# EAGLE design RS232_2xNPN_Alt (EAGLE 7.7.0)
RS232 Adapter using two NPN Transistors
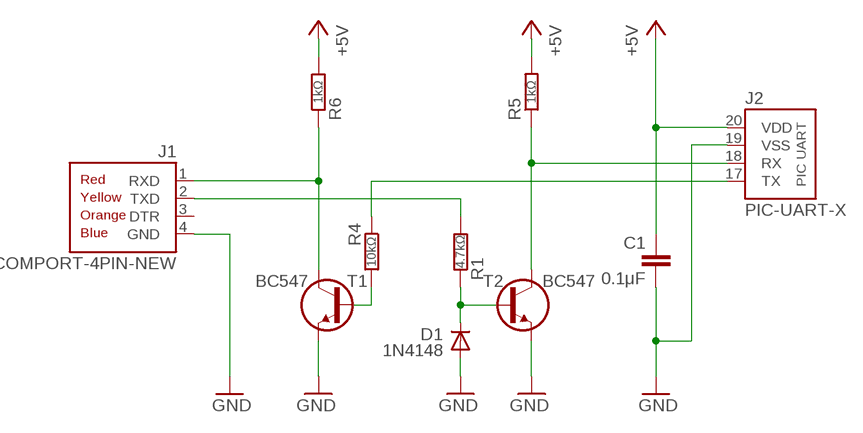
[diagram p0: schematic, sheet 1]

## Parts
C1  0.1μF  C025-015X024  [C025-015X024]
D1  1N4148  1N414834-7  [DO34-7]
J1  COMPORT-4PIN-NEW  [RS232-4PIN-NEW]
J2  PIC-UART-X  [PIC-UART-X]
R1  4.7kΩ  R0202/7  [0202/7]
R4  10kΩ  R0204/7-V  [0204/7-V]
R5  1kΩ  R0204/7-V  [0204/7-V]
R6  1kΩ  R0204/7  [0204/7]
T1  BC547  BC547CBE  [TO92-CBE]
T2  BC547  BC547CBE  [TO92-CBE]

## Nets
+5V: C1.1 J2.20(VDD) R5.2 R6.2
GND: C1.2 D1.A J1.4(GND) J2.19(VSS) T1.E T2.E
N$1: J2.18(RX) R5.1 T2.C
N$2: D1.C R1.1 T2.B
N$3: J1.2(TXD) R1.2
N$4: J2.17(TX) R4.1
N$5: R4.2 T1.B
N$9: J1.1(RXD) R6.1 T1.C
Unconnected: J1.3(DTR)

## Library data of the parts
C1 = c:C: CAPACITOR, European symbol
D1 = d:1N4148
J1 = pinconn:COMPORT-4PIN-NEW
J2 = pinconn:PIC-UART
R1 R4-R6 = r:R: RESISTOR, European symbol
T1 T2 = t:BC547

## Net classes
0 default: width 0.61 mm

## Board
RS232 Adapter using two NPN Transistors
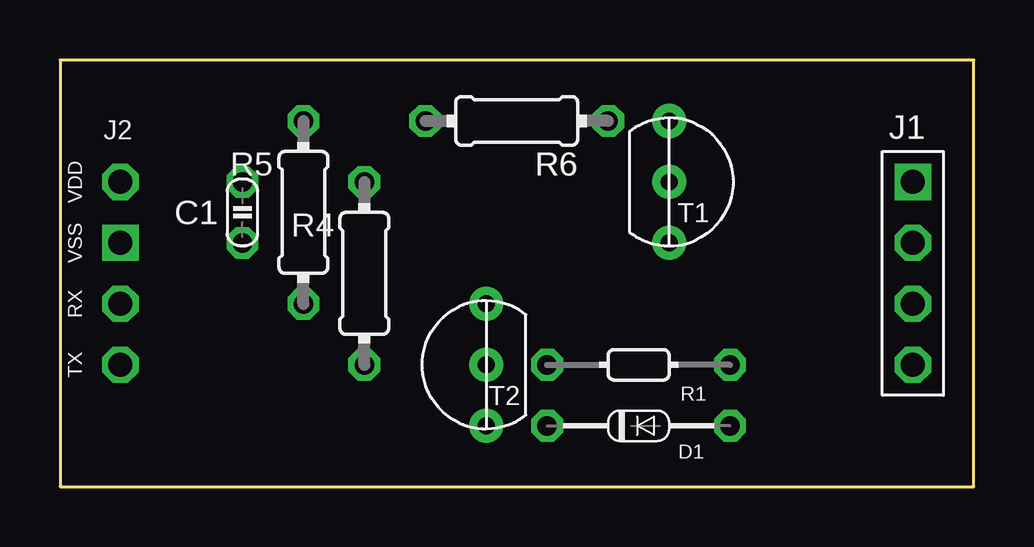
[diagram p1: board, top side]
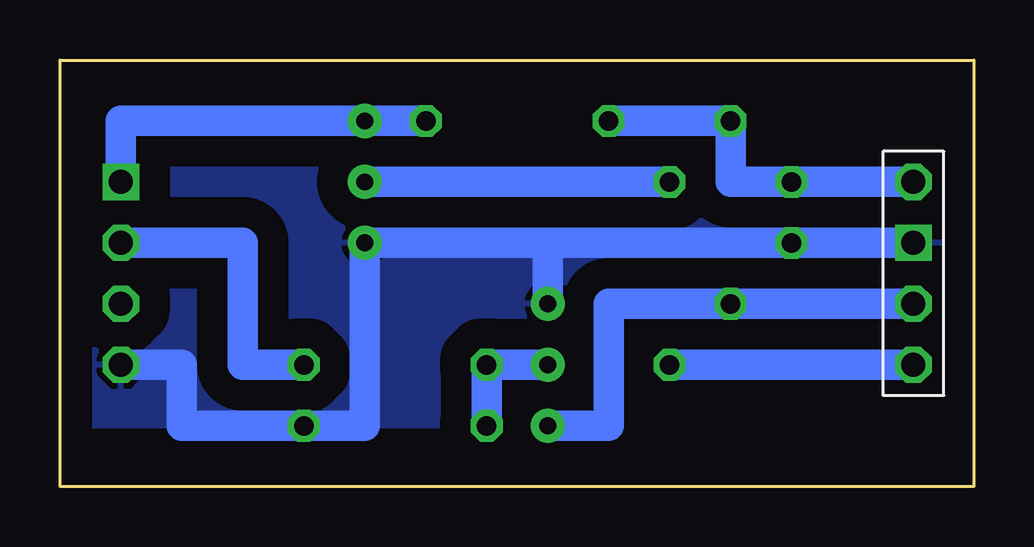
[diagram p2: board, bottom side, seen from below]

Size 38.08 x 17.78 mm. Coordinates in mm from the lower left corner, seen from the top.
Outline: 38.08,17.78 0,17.78 0,0 38.08,0 38.08,17.78
Copper layers (1*16): Top 0.035mm / dielectric 1.5mm / Bottom 0.035mm
Design rules "default": minimum track width 10mil, minimum drill 24mil, track to track 8mil, track to pad 8mil, pad to pad 8mil, via to via 8mil, smd to smd 8mil, copper to edge 40mil, drill to drill 8mil, minimum pad ring 10mil, minimum via ring 8mil, stop-mask expansion 4mil, vias tented up to drill 0mil, thermal gap 10mil

### Footprints (pad centres in the part's own frame; a part is rotated, then mirrored left to right if it is on the bottom)
C025-015X024 = drill 0.813 octagon: 1 0,1.27; 2 0,-1.27
DO34-7 = drill 0.813 octagon: A 3.81,0; C -3.81,0
RS232-4PIN-NEW = drill 1 square: 1 0,-3.81 | drill 1 octagon: 2 0,-1.27; 3 0,1.27; 4 0,3.81
PIC-UART-X = drill 1 octagon: 17 0,-3.81; 18 0,-1.27; 20 0,3.81 | drill 1 square: 19 0,1.27
0202/7 = drill 0.813 octagon: 1 -3.81,0; 2 3.81,0
0204/7-V = drill 0.813 octagon: 1 0,-3.81; 2 0,3.81
0204/7 = drill 0.813 octagon: 1 -3.81,0; 2 3.81,0
TO92-CBE = drill 0.7 pad 1.422: B 0,0; C 0,2.54; E 0,-2.54

### Placement (x,y rotation side)
C1  7.6,11.43 0 top
D1  24.11,2.54 0 top
J1  35.54,8.89 180 top
J2  2.52,8.89 0 top
R1  24.11,5.08 0 top
R4  12.68,8.89 0 top
R5  10.14,11.43 0 top
R6  19.03,15.24 180 top
T1  25.38,12.7 0 top
T2  17.76,5.08 180 top

### Tracks (layer width: path | path; a pad name or v marks a point on that pad's centre or on a via)
+5V
  Bottom 1.27: J2.20 C1.1 10.14,12.7 R5.2 R6.2
GND
  Bottom 1.27: J1.4 33,5.08 33,2.54 D1.A 25.38,2.54 T1.E 17.76,10.16 | T2.E 17.76,10.16 | J2.19 C1.2 17.76,10.16
  pour Bottom (isolate 1.27): 1.25,17.78 1.25,2.54 38.08,2.54 38.08,17.78
N$1
  Bottom 1.27: T2.C 15.22,2.54 15.22,7.62 R5.1 J2.18
N$2
  Bottom 1.27: T2.B R1.1 D1.C
N$3
  Bottom 1.27: R1.2 30.46,5.08 30.46,10.16 J1.2
N$4
  Bottom 1.27: R4.1 J2.17
N$5
  Bottom 1.27: T1.B R4.2
N$9
  Bottom 1.27: R6.1 T1.C 35.54,15.24 J1.1